# EAGLE design Fauxzer (EAGLE 9.6.0)
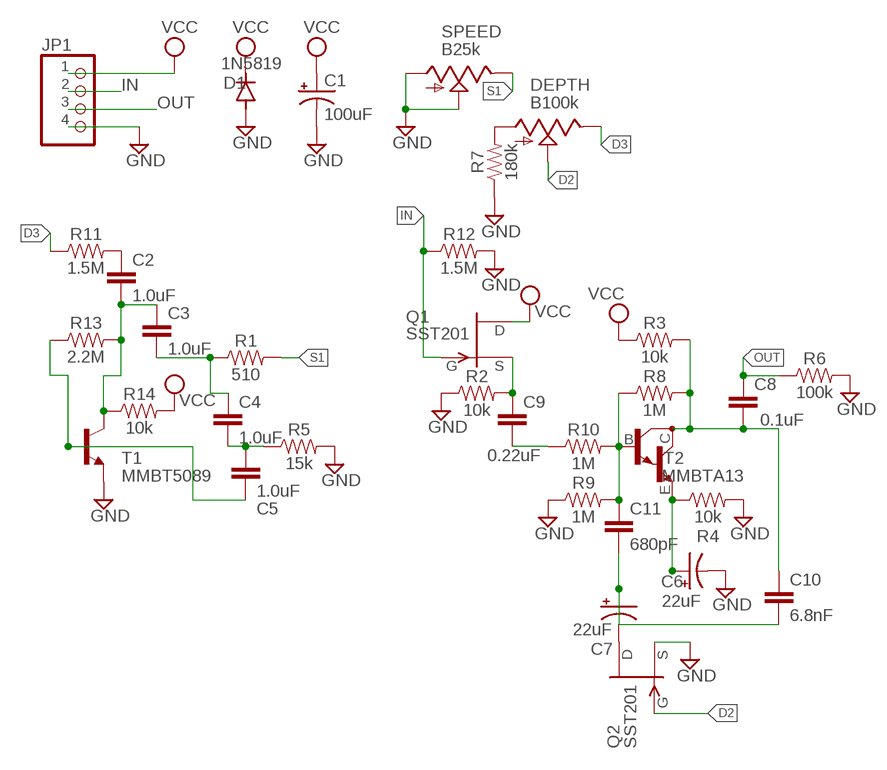
[diagram p0: schematic, sheet 1]

## Parts
C1  100uF  CAP_SMD+THRUPAN_B  [PAN_B_SMD+THRU]
C2  1.0uF  1.0UF-0805-25V-10%  [0805]
C3  1.0uF  1.0UF-0805-25V-10%  [0805]
C4  1.0uF  1.0UF-0805-25V-10%  [0805]
C5  1.0uF  1.0UF-0805-25V-10%  [0805]
C6  22uF  CAP_SMD+THRUPAN_B  [PAN_B_SMD+THRU]
C7  22uF  CAP_SMD+THRUPAN_B  [PAN_B_SMD+THRU]
C8  0.1uF  0.1UF-0603-25V-(+80/-20%)  [0603]
C9  0.22uF  0.22UF-0603-25V-10%  [0603]
C10  6.8nF  3.3NF-0603-100V-10%  [0603]
C11  680pF  680PF-0603-50V-10%  [0603]
D1  1N5819  DIODE-SOD123  [SOD123]
DEPTH  B100k  9MM_SNAP-IN_POT_  [9MM_SNAP-IN_POT]
JP1  PINHD-1X4  [1X04]
Q1  SST201  [SOT23]
Q2  SST201  [SOT23]
R1  510  470OHM-0603-1/10W-1%  [0603]
R2  10k  10KOHM-0603-1/10W-1%  [0603]
R3  10k  10KOHM-0603-1/10W-1%  [0603]
R4  10k  10KOHM-0603-1/10W-1%  [0603]
R5  15k  15KOHM-0603-1/10W-1%  [0603]
R6  100k  100KOHM-0603-1/10W-1%  [0603]
R7  180k  180KOHM-0603-1/10W-1%  [0603]
R8  1M  1MOHM-0603-1/4W-5%  [0603]
R9  1M  1MOHM-0603-1/4W-5%  [0603]
R10  1M  1MOHM-0603-1/4W-5%  [0603]
R11  1.5M  1.2MOHM-0603-1/10W-1%  [0603]
R12  1.5M  1.2MOHM-0603-1/10W-1%  [0603]
R13  2.2M  2.2KOHM-0603-1/10W-1%  [0603]
R14  10k  10KOHM-0603-1/10W-1%  [0603]
SPEED  B25k  9MM_SNAP-IN_POT_  [9MM_SNAP-IN_POT]
T1  MMBT5089  BC808-NPN-SOT23-BEC  [SOT23-BEC]
T2  MMBTA13  MMBTA13LT1-NPN_DARL-SOT23-BEC  [SOT23-BEC]

## Nets
D2: DEPTH.2(S) Q2.3(G)
D3: DEPTH.3(E) R11.1
GND: C1.- C1.--(-) C6.- C6.--(-) D1.A JP1.4 Q2.2(S) R2.1 R4.2 R5.2 R6.2 R7.1 R9.1 R12.2 SPEED.1(A) SPEED.2(S) T1.E
IN: JP1.2 Q1.3(G) R12.1
N$1: C2.1 R11.2
N$2: C9.1 Q1.2(S) R2.2
N$3: C9.2 R10.1
N$4: C11.1 R8.1 R9.2 R10.2 T2.B
N$5: C7.+ C7.++(+) C10.2 C11.2
N$6: C7.- C7.--(-) Q2.1(D)
N$7: C8.2 C10.1 R3.2 R8.2 T2.C
N$8: C6.+ C6.++(+) R4.1 T2.E
N$9: DEPTH.1(A) R7.2
N$10: C3.2 C4.1 R1.1
N$11: C2.2 C3.1 R13.2 R14.1 T1.C
N$12: C5.2 R13.1 T1.B
N$13: C4.2 C5.1 R5.1
OUT: C8.1 JP1.3 R6.1
S1: R1.2 SPEED.3(E)
VCC: C1.+ C1.++(+) D1.C JP1.1 Q1.1(D) R3.1 R14.2

## Library data of the parts
C1 C6 C7 = MusicThingModular:CAP_SMD+THRU
C2-C5 = SparkFun-Capacitors:1.0UF: 1µF ceramic capacitors A capacitor is a passive two-terminal electrical component used to store electrical energy temporarily in an electric field.; PROD_ID: CAP-08064
C8 = SparkFun-Capacitors:0.1UF: 0.1µF ceramic capacitors A capacitor is a passive two-terminal electrical component used to store electrical energy temporarily in an electric field.; PROD_ID: CAP-00810
C9 = SparkFun-Capacitors:0.22UF: 0.22µF ceramic capacitors A capacitor is a passive two-terminal electrical component used to store electrical energy temporarily in an electric field.; PROD_ID: CAP-07822
C10 = SparkFun-Capacitors:3.3NF: 3.3nF ceramic capacitors A capacitor is a passive two-terminal electrical component used to store electrical energy temporarily in an electric field.; PROD_ID: CAP-09633; VALUE: 3.3nF
C11 = SparkFun-Capacitors:680PF: 680pF/0.68nF ceramic capacitors A capacitor is a passive two-terminal electrical component used to store electrical energy temporarily in an electric field.; PROD_ID: CAP-09232
D1 = diode:DIODE-: DIODE
DEPTH SPEED = MusicThingModular:9MM_SNAP-IN_POT: 9mm vertical snap-in pot, Alpha / Panasonic style
JP1 = Connector:PINHD-1X4: PIN HEADER; CATEGORY: CONNECTOR; SUB-CATEGORY: PIN-HEADER
Q1 Q2 = transistor-fet:?20*: TEMIC / Siliconix N-Channel JFET Source: JFET-J201_Siliconix_data.pdf
R1 = SparkFun-Resistors:470OHM: 470Ω resistor A resistor is a passive two-terminal electrical component that implements electrical resistance as a circuit element. Resistors act to reduce current flow, and, at the same time, act to lower voltage levels within circuits. - Wikipedia; PROD_ID: RES-07869; VALUE: 470
R2-R4 R14 = SparkFun-Resistors:10KOHM: 10kΩ resistor A resistor is a passive two-terminal electrical component that implements electrical resistance as a circuit element. Resistors act to reduce current flow, and, at the same time, act to lower voltage levels within circuits. - Wikipedia; PROD_ID: RES-00824
R5 = SparkFun-Resistors:15KOHM: 15kΩ resistor A resistor is a passive two-terminal electrical component that implements electrical resistance as a circuit element. Resistors act to reduce current flow, and, at the same time, act to lower voltage levels within circuits. - Wikipedia; PROD_ID: RES-07854
R6 = SparkFun-Resistors:100KOHM: 100kΩ resistor A resistor is a passive two-terminal electrical component that implements electrical resistance as a circuit element. Resistors act to reduce current flow, and, at the same time, act to lower voltage levels within circuits. - Wikipedia; PROD_ID: RES-07828
R7 = SparkFun-Resistors:180KOHM: RES-10066; PROD_ID: RES-10066
R8-R10 = SparkFun-Resistors:1MOHM: 1MΩ resistor A resistor is a passive two-terminal electrical component that implements electrical resistance as a circuit element. Resistors act to reduce current flow, and, at the same time, act to lower voltage levels within circuits. - Wikipedia; PROD_ID: RES-07868
R11 R12 = SparkFun-Resistors:1.2MOHM: 1.2MΩ resistor A resistor is a passive two-terminal electrical component that implements electrical resistance as a circuit element. Resistors act to reduce current flow, and, at the same time, act to lower voltage levels within circuits. - Wikipedia; PROD_ID: RES-10055; VALUE: 1.2M
R13 = SparkFun-Resistors:2.2KOHM: 2.2kΩ resistor A resistor is a passive two-terminal electrical component that implements electrical resistance as a circuit element. Resistors act to reduce current flow, and, at the same time, act to lower voltage levels within circuits. - Wikipedia; PROD_ID: RES-08272; VALUE: 2.2k
T1 = MusicThingModular:*-NPN-: NPN Transistror BF959 corrected 2008.03.06
T2 = transistor-neu-to92:*-NPN_DARL-: NPN Darlington Transistor

## Board
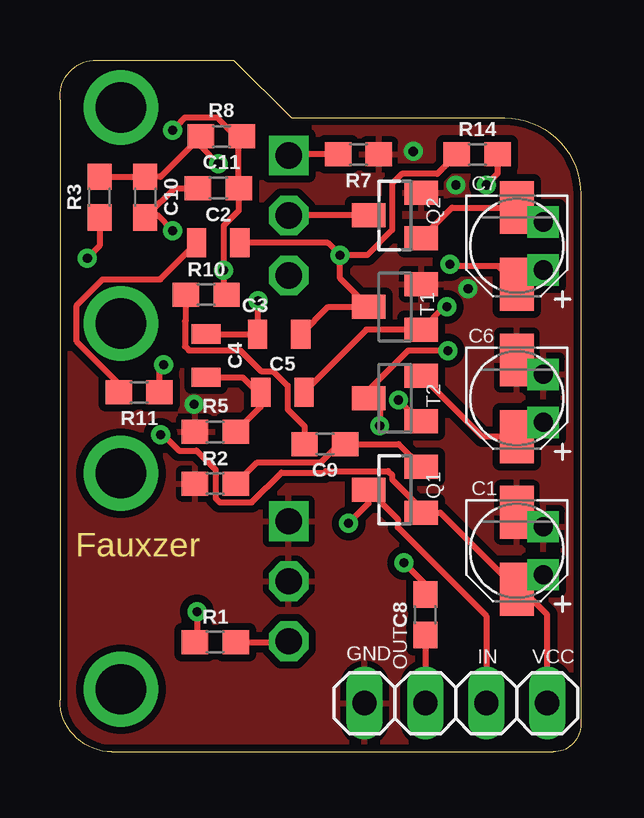
[diagram p1: board, top side]
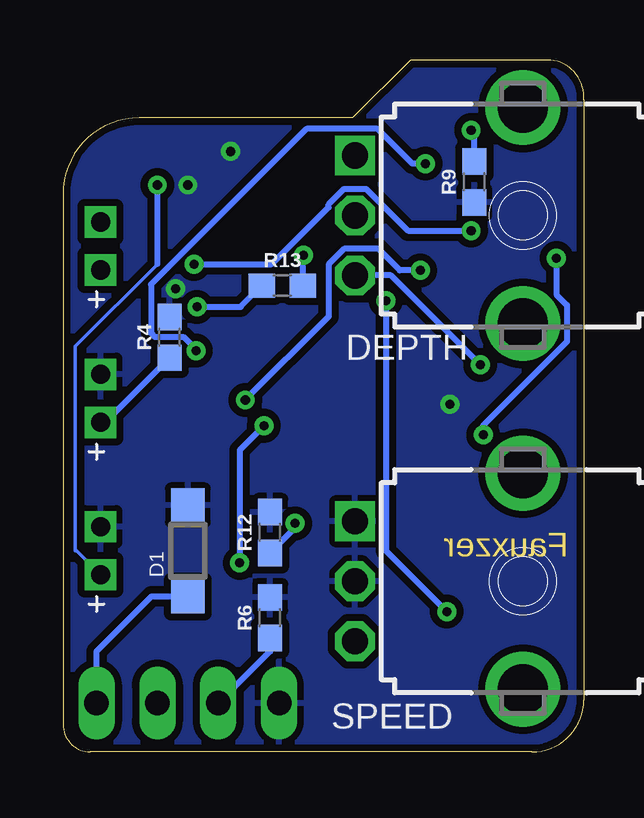
[diagram p2: board, bottom side, seen from below]

Size 21.72 x 28.83 mm. Coordinates in mm from the lower left corner, seen from the top.
Outline: 2.16,0 20.57,0 arc90 21.72,1.14 21.72,23.24 arc90 18.54,26.42 9.65,26.42 7.24,28.83 1.52,28.83 arc90 0,27.3 0,27.18 0,2.16 arc90 2.16,0
Copper layers (1*16): Top 0.035mm / dielectric 1.5mm / Bottom 0.035mm
Design rules "default *": minimum track width 6mil, minimum drill 0.35mm, track to track 6mil, track to pad 6mil, pad to pad 6mil, via to via 6mil, smd to smd 6mil, copper to edge 10mil, drill to drill 6mil, minimum pad ring 10mil, minimum via ring 8mil, stop-mask expansion 4mil, vias tented up to drill 0mil, thermal gap 10mil

### Footprints (pad centres in the part's own frame; a part is rotated, then mirrored left to right if it is on the bottom)
PAN_B_SMD+THRU = smd 2.2 x 1.4: + 1.6,0; - -1.6,0 | drill 0.8 pad 0.9 square: ++ 1,1.1; -- -1,1.1
0805 = smd 0.8 x 1.2: 1 -0.9,0; 2 0.9,0
0603 = smd 1.1 x 1: 1 -0.85,0; 2 0.85,0
SOD123 = smd 1.4 x 1.4: A 1.9,0; C -1.9,0
9MM_SNAP-IN_POT = drill 1.1 square: 1 -2.5,-7 | drill 1.1 octagon: 2 0,-7; 3 2.5,-7 | drill 2.1 pad 2.794: CHASSIS1 -4.5,0; CHASSIS2 4.5,0
1X04 = drill 1.016 long: 1 -3.81,0; 2 -1.27,0; 3 1.27,0; 4 3.81,0
SOT23 = smd 1 x 1.4: 1 -0.95,-1.1; 2 0.95,-1.1; 3 0,1.1
SOT23-BEC = smd 1 x 1.4: B -0.95,-1.1; C 0,1.1; E 0.95,-1.1

### Placement (x,y rotation side)
C1  19.05,8.38 270 top
C2  6.6,21.21 0 top
C3  9.14,17.4 180 top
C4  6.1,16.51 270 top
C5  9.27,14.99 0 top
C6  19.05,14.73 270 top
C7  19.05,21.08 270 top
C8  15.24,5.71 90 top
C9  11.05,12.83 180 top
C10  3.56,23.11 270 top
C11  6.6,23.5 180 top
D1  16.51,8.38 90 bottom
DEPTH  2.54,22.35 270 bottom
JP1  16.51,2.03 180 top
Q1  13.97,10.92 90 top
Q2  13.97,22.35 90 top
R1  6.48,4.57 0 top
R2  6.48,11.18 0 top
R3  1.65,23.11 90 top
R4  17.27,17.27 90 bottom
R5  6.48,13.34 180 top
R6  13.08,5.59 90 bottom
R7  12.45,24.89 180 top
R8  6.73,25.65 180 top
R9  4.57,23.75 90 bottom
R10  6.1,19.05 0 top
R11  3.3,14.99 180 top
R12  13.08,9.14 90 bottom
R13  12.57,19.43 0 bottom
R14  17.4,24.89 0 top
SPEED  2.54,7.11 270 bottom
T1  13.97,18.54 90 top
T2  13.97,14.73 90 top

### Tracks (layer width: path | path; a pad name or v marks a point on that pad's centre or on a via)
D2
  Top 0.254: Q2.3 DEPTH.2
D3  (via drill 0.38)
  Top 0.254: R11.1 4.15,15.96 v4.32,16.13
  Bottom 0.254: v4.32,16.13 7.18,18.99 8.04,19.85 DEPTH.3
GND  (via drill 0.38)
  other vias: 14.73,25.02 16.51,23.62 5.59,14.48 17.02,19.3
  pour Top (isolate 0.305): -0.38,29.21 -0.38,-0.64 22.23,-0.64 22.35,-0.51 22.35,29.34 22.23,29.46 -0.13,29.46
  pour Bottom (isolate 0.305): -0.38,29.21 -0.38,-0.51 -0.25,-0.64 22.35,-0.64 22.35,29.34 -0.25,29.34
IN  (via drill 0.38)
  Top 0.254: JP1.2 17.78,5.67 14.09,9.36 14.09,9.7 Q1.3 12.87,10.36 v12.04,9.53
  Bottom 0.254: R12.1 12.04,9.34 v12.04,9.53
N$1
  Top 0.254: R11.2 2.45,15.34 0.7,17.09 0.7,18.61 1.78,19.69 4.18,19.69 C2.1
N$2
  Top 0.254: R2.2 8.2,12.05 10.87,12.05 11.64,12.83 C9.1 14.12,12.83 Q1.2
N$3
  Top 0.254: R10.1 5.25,17.95 5.22,17.93 5.22,16.89 5.38,16.73 7.52,16.73 8.38,15.87 8.89,15.87 9.49,15.26 9.49,14.27 10.2,13.56 C9.2
N$4  (via drill 0.38)
  Top 0.254: R10.2 6.82,19.18 v6.82,20.06 v6.83,20.07 6.83,21.93 7.45,22.55 C11.1 7.45,25.53 R8.1 7.33,25.65 6.55,26.43 5.21,26.43 5.05,26.27 5.05,26.26 v4.7,25.91 | v14.12,14.66 15,13.78 T2.B
  Bottom 0.254: R9.2 4.57,25.78 v4.7,25.91 | v6.82,20.06 7.68,20.06 8.57,20.96 10,20.96 10.64,20.31 10.64,18.14 v14.12,14.66
N$5  (via drill 0.38)
  Top 0.254: C10.2 3.66,22.37 | 3.66,22.37 4.79,23.5 C11.2 | C7.++ 19.65,20.08 C7.+ 18.29,20.24 16.33,20.24 v16.26,20.32 | v4.7,21.72 4.04,22.37 3.66,22.37
  Bottom 0.254: v16.26,20.32 13.02,20.32 10.64,22.69 10.64,22.81 10,23.46 9.08,23.46 7.34,21.72 v4.7,21.72
N$6
  Top 0.254: Q2.1 16.35,22.68 C7.- 19.55,22.68 C7.--
N$7  (via drill 0.38)
  Top 0.254: R3.2 C10.1 4.19,23.96 R8.2 5.88,25.23 v6.6,24.51 | v13.34,13.59 13.34,14.27 T2.C 12.87,15.08 14.51,16.72 v16.17,16.72 | v14.35,7.87 15.24,6.99 C8.2
  Bottom 0.254: v13.34,13.59 14.35,12.57 v14.35,7.87 | v6.6,24.51 7.15,24.51 8.6,25.96 11.57,25.96 18.05,19.48 18.05,17.46 17.89,17.29 16.7,17.29 16.17,16.77 v16.17,16.72
N$8
  Top 0.254: T2.E 17.62,13.13 C6.+ 19.65,13.73 C6.++
  Bottom 0.254: C6.++ 19.96,13.73 R4.1
N$9
  Top 0.254: R7.2 9.58,24.89 DEPTH.1
N$10  (via drill 0.38)
  Top 0.254: C4.1 C3.2 8.26,17.41 v8.26,18.8 | v5.71,5.84 5.71,4.66 R1.1
  Bottom 0.254: v8.26,18.8 8.26,8.38 v5.71,5.84
N$11  (via drill 0.38)
  Top 0.254: v11.68,20.7 11.68,19.73 T1.C 11.19,18.54 C3.1 | v11.68,20.7 11.18,21.21 C2.2 | R14.1 15.74,24.08 14.25,24.08 13.85,23.68 13.85,21.74 12.81,20.7 v11.68,20.7
  Bottom 0.254: v11.68,20.7 11.72,20.66 R13.2
N$12  (via drill 0.38)
  Top 0.254: C5.2 12.78,17.59 T1.B 16.02,18.54 v16.13,18.54
  Bottom 0.254: v16.13,18.54 14.31,18.54 R13.1
N$13
  Top 0.254: R5.1 8.37,14.38 8.37,14.86 | 8.37,14.86 C5.1 | C4.2 7.62,15.61 8.37,14.86
OUT
  Top 0.254: C8.1 JP1.3
  Bottom 0.254: JP1.3 13.08,4.19 R6.1
S1
  Top 0.254: R1.2 9.5,4.57 SPEED.3
VCC  (via drill 0.38)
  Top 0.254: JP1.1 20.32,5.71 19.25,6.78 C1.+ | C1.+ 19.55,6.78 C1.++ | Q1.1 15.24,9.97 | 15.24,9.97 15.86,9.97 C1.+ | R3.1 1.65,21.08 v1.14,20.57 | 15.24,9.97 13.85,11.36 13.85,11.54 13.69,11.7 11.09,11.7 11.03,11.64 9.24,11.64 7.99,10.4 6.66,10.4 6.5,10.56 6.5,11.75 5.69,12.56 4.96,12.56 4.31,13.21 v4.19,13.21 | R14.2 18.25,24.09 v17.78,23.62
  Bottom 0.152: C1.++ 21.15,8.38 21.21,8.38 21.21,16.89 17.78,20.32
  Bottom 0.254: JP1.1 20.32,4.19 18.03,6.48 D1.C | v1.14,20.57 1.14,19.05 0.7,18.61 0.7,17.09 4.19,13.6 v4.19,13.21 | 17.78,20.32 v17.78,23.62

### Text on the board
Dimension: Fauxzer
tPlace: GND | IN | VCC | OUT